# Altium schematic sheet LoRa_PWR_Monitor.SchDoc
size 420 x 297 mm; Date: TEST; SheetNumber: 1; SheetTotal: 1; Sheet_Text_ProjectName: LoRa_PWR_Monitor; Sheet_Text_Author: mtnguyen; Sheet_Text_Title: LoRa_PWR_Monitor; Sheet_Text_Rev: 1.0.0; Sheet_Text_Date: Dec 23, 24; SPICEModelCacheXPRDUAEM: <root> / <DocumentId>XPRDUAEM</DocumentId> / <CacheFrame Number="0"> / <Model Name="emk105bj105_v-f" Kind="CKT"> / <Text>* EMK105BJ105_V-F     SPICE MODEL  ( General Type ) / *-------------------------------------------------------------------------------------------------------- / * Model Generated by TAIYO YUDEN Corporation (http://www.ty-top.com) / * Version 1.0 / * TAIYO YUDEN Control No. 170508_130520 / * Copyright(c) 2012 TAIYO YUDEN CO.,LTD. All Rights Reserved. / *-------------------------------------------------------------------------------------------------------- / * / * Products Name : Multilayer Ceramic Capacitors / * / * Characteristics : / *     Capacitance : 1 uF , Rated Voltage : 16V , TCC : X5R / *     Case Size : 1.0 x 0.5 / 0.039 x 0.02 [mm/inch] , Thickness : 0.5 / 0.02 [mm/inch] / *     (Conditions: Temperature = 25 degC , DC Bias Current/Voltage = 0A / 0V) / * / * Frequency Range : 40Hz - 3GHz / * / * External Node Assignments : / * / *  1  o---| |---o  2 / * / *-------------------------------------------------------------------------------------------------------- / .SubCkt EMK105BJ105_V-F 1 2 / **************************** / C0 1 110 0.68309u / Cm 1 101 0.26053u / C1 101 102 0.94076u / Rc1 101 102 1.9029k / C2 102 103 0.66707u / Rc2 102 103 120.36 / C3 103 110 0.57203u / Rc3 103 110 2.1097 / C2m 1 301 0.1871u / C21 301 302 3.2494u / Rc21 301 302 1.1117k / C22 302 303 2.1014u / Rc22 302 303 1.484k / C23 303 304 2.1172u / Rc23 303 304 1.3876k / C24 304 305 0.75729u / Rc24 304 305 332.59 / C25 305 306 0.94401u / Rc25 305 306 249.09 / C26 306 307 0.34674u / Rc26 306 307 28.352 / C27 307 308 0.37158u / Rc27 307 308 19.989 / C28 308 309 0.17933u / Rc28 308 309 31.748 / C29 309 110 0.016445u / Rc29 309 110 1.0592 / Rp0 1 110 100Meg / L0 110 120 0.2216n / Lm 120 130 0.1509n / L1 120 121 0.12659n / RL1 121 130 0.85161 / L2 120 122 0.15996n / RL2 122 130 0.42469 / L3 120 123 7.9543n / RL3 123 130 0.54643m / CR 120 124 0.24334u / LR 124 125 0.090738n / RR 125 130 68.076m / CL 130 140 2.7354p / LL 130 140 0.10762n / RL 130 140 50.614 / Rs 140 2 7.5416m / **************************** / .ends EMK105BJ105_V-F</Text> / </Model> / </CacheFrame> / </root>
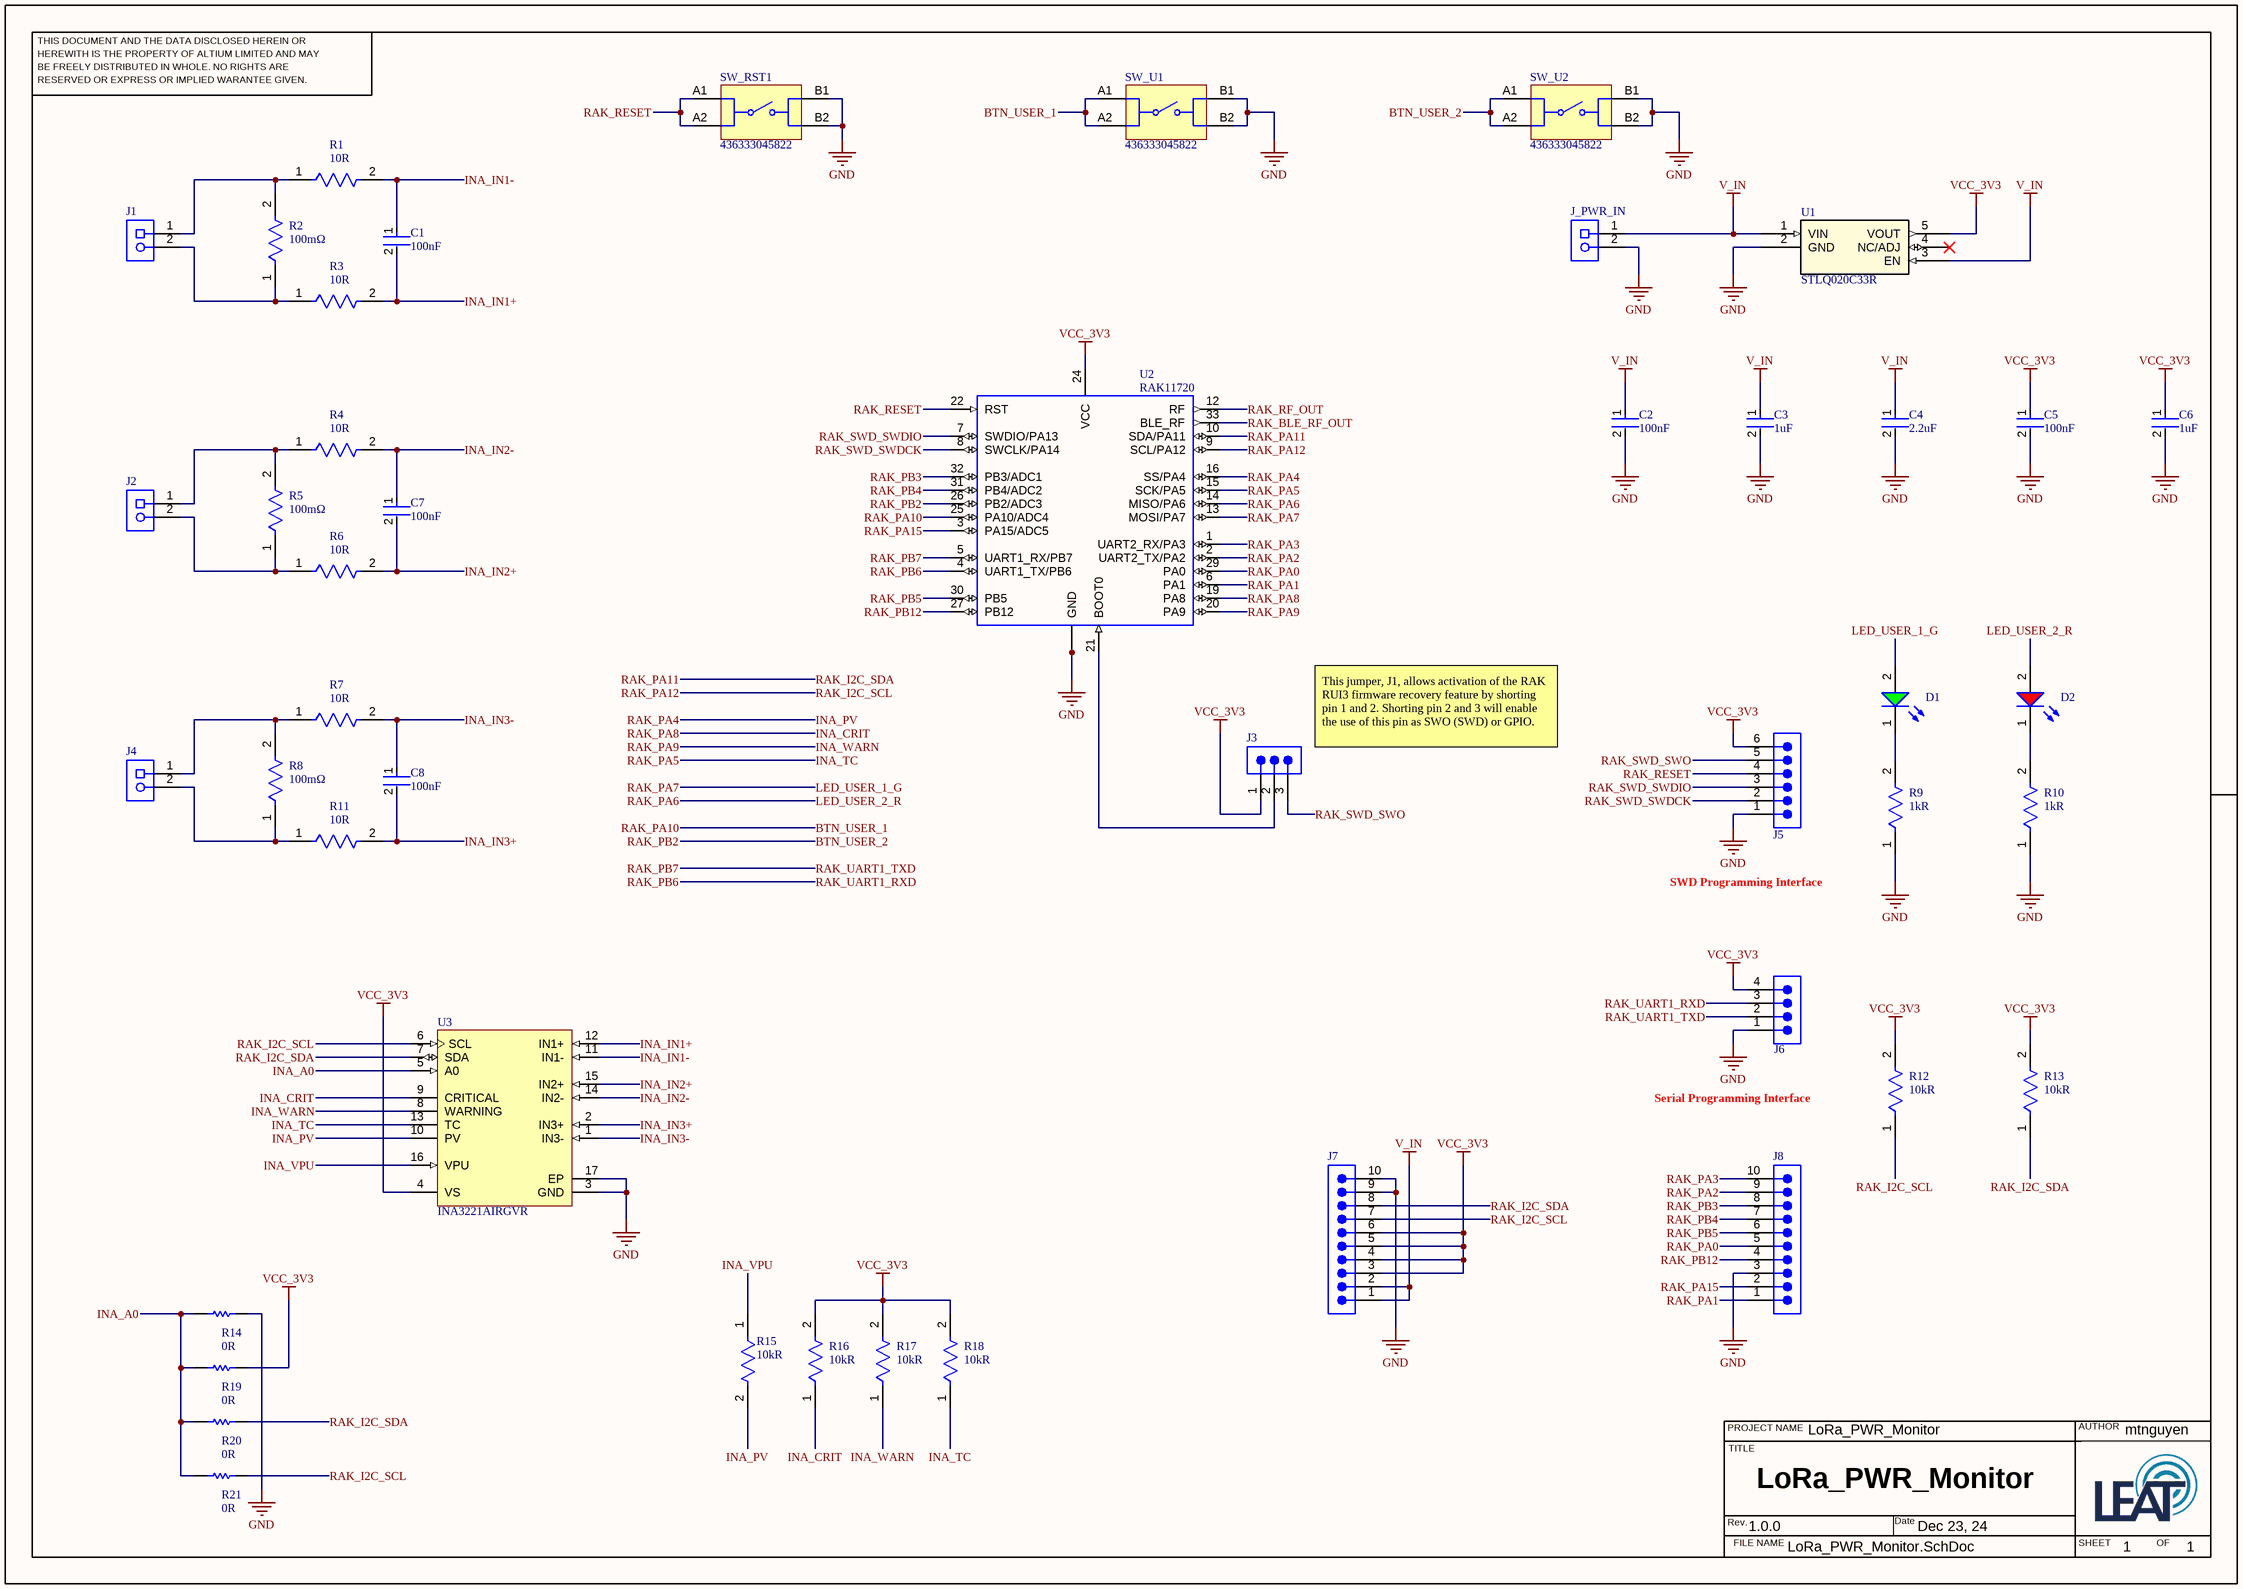
[diagram p0: LoRa_PWR_Monitor.SchDoc]

## Parts
C1  Capacitance: 100nF  [FP-0402-L_1_0_1-W_0_5_0_1-IPC_C]  (hidden comment: 0402ZD104KAT2A)
C2  Capacitance: 100nF  [FP-0402-L_1_0_1-W_0_5_0_1-IPC_C]  (hidden comment: 0402ZD104KAT2A)
C3  Capacitance: 1uF  [FP-0402-L_1_0_0_05-W_0_5-IPC_A]  (hidden comment: EMK105BJ105KV-F)
C4  Capacitance: 2.2uF  [FP-C1005-050-0_05-IPC_A]  (hidden comment: C1005X5R1A225K050BC)
C5  Capacitance: 100nF  [FP-0402-L_1_0_1-W_0_5_0_1-IPC_C]  (hidden comment: 0402ZD104KAT2A)
C6  Capacitance: 1uF  [FP-0402-L_1_0_0_05-W_0_5-IPC_A]  (hidden comment: EMK105BJ105KV-F)
C7  Capacitance: 100nF  [FP-0402-L_1_0_1-W_0_5_0_1-IPC_C]  (hidden comment: 0402ZD104KAT2A)
C8  Capacitance: 100nF  [FP-0402-L_1_0_1-W_0_5_0_1-IPC_C]  (hidden comment: 0402ZD104KAT2A)
D1  150060VS75000  [WL-SMCW_0603_150060xx75000]  (value not drawn)
D2  150060RS75000  [WL-SMCW_0603_150060xx75000]  (value not drawn)
J1  1729128  [PHOE-1729128-2_V]  (value not drawn)
J2  1729128  [PHOE-1729128-2_V]  (value not drawn)
J3  61300311121  [61300311121]  (value not drawn)
J4  1729128  [PHOE-1729128-2_V]  (value not drawn)
J5  61300611121  [61300611121]  (value not drawn)
J6  61300411121  [61300411121]  (value not drawn)
J7  61301011121  [61301011121]  (value not drawn)
J8  61301011121  [61301011121]  (value not drawn)
J_PWR_IN  1729128  [PHOE-1729128-2_V]  (value not drawn)
R1  Resistance: 10R  [FP-MCR01-IPC_C]  (hidden comment: MCR01MZPF10R0)
R2  value 100mΩ  [FP-CRM2512-MFG]  (hidden comment: CRM2512-FX-R100ELF)
R3  Resistance: 10R  [FP-MCR01-IPC_C]  (hidden comment: MCR01MZPF10R0)
R4  Resistance: 10R  [FP-MCR01-IPC_C]  (hidden comment: MCR01MZPF10R0)
R5  value 100mΩ  [FP-CRM2512-MFG]  (hidden comment: CRM2512-FX-R100ELF)
R6  Resistance: 10R  [FP-MCR01-IPC_C]  (hidden comment: MCR01MZPF10R0)
R7  Resistance: 10R  [FP-MCR01-IPC_C]  (hidden comment: MCR01MZPF10R0)
R8  value 100mΩ  [FP-CRM2512-MFG]  (hidden comment: CRM2512-FX-R100ELF)
R9  Resistance: 1kR  [FP-RMCF0402-IPC_A]  (hidden comment: RMCF0402FT1K00)
R10  Resistance: 1kR  [FP-RMCF0402-IPC_A]  (hidden comment: RMCF0402FT1K00)
R11  Resistance: 10R  [FP-MCR01-IPC_C]  (hidden comment: MCR01MZPF10R0)
R12  Resistance: 10kR  [FP-RMCF0402-IPC_C]  (hidden comment: RMCF0402FT10K0)
R13  Resistance: 10kR  [FP-RMCF0402-IPC_C]  (hidden comment: RMCF0402FT10K0)
R14  Resistance: 0R  [RESC1005X40X25LL05T10]  (hidden comment: RC1005J000CS)
R15  Resistance: 10kR  [FP-RMCF0402-IPC_C]  (hidden comment: RMCF0402FT10K0)
R16  Resistance: 10kR  [FP-RMCF0402-IPC_C]  (hidden comment: RMCF0402FT10K0)
R17  Resistance: 10kR  [FP-RMCF0402-IPC_C]  (hidden comment: RMCF0402FT10K0)
R18  Resistance: 10kR  [FP-RMCF0402-IPC_C]  (hidden comment: RMCF0402FT10K0)
R19  Resistance: 0R  [RESC1005X40X25LL05T10]  (hidden comment: RC1005J000CS)
R20  Resistance: 0R  [RESC1005X40X25LL05T10]  (hidden comment: RC1005J000CS)
R21  Resistance: 0R  [RESC1005X40X25LL05T10]  (hidden comment: RC1005J000CS)
SW_RST1  436333045822  [436333045822]
SW_U1  436333045822  [436333045822]
SW_U2  436333045822  [436333045822]
U1  STLQ020C33R  [SOT323-5L_STM]
U2  RAK11720  [RAK11720]
U3  INA3221AIRGVR  [RGV0016A_V]

## Nets
GND: C2.2 C3.2 C4.2 C5.2 C6.2 J5.1 J6.1 J7.9 J7.10 J8.3 J_PWR_IN.2 R9.1 R10.1 R14.2 SW_RST1.B1 SW_RST1.B2 SW_U1.B1 SW_U1.B2 SW_U2.B1 SW_U2.B2 U1.2(GND) U2.11(GND) U2.17(GND) U2.18(GND) U2.23(GND) U2.28(GND) U2.34(GND) U3.3(GND) U3.17(EP)
V_IN: C2.1 C3.1 C4.1 J7.1 J7.2 J_PWR_IN.1 U1.1(VIN) U1.3(EN)
VCC_3V3: C5.1 C6.1 J3.1 J5.6 J6.4 J7.3 J7.4 J7.5 J7.6 R12.2 R13.2 R16.2 R17.2 R18.2 R19.2 U1.5(VOUT) U2.24(VCC) U3.4(VS)
BTN_USER_1: SW_U1.A1 SW_U1.A2 U2.25(PA10/ADC4)  [also labelled RAK_PA10]
BTN_USER_2: SW_U2.A1 SW_U2.A2 U2.26(PB2/ADC3)  [also labelled RAK_PB2]
INA_A0: R14.1 R19.1 R20.1 R21.1 U3.5(A0)
INA_CRIT: R16.1 U2.19(PA8) U3.9(CRITICAL)  [also labelled RAK_PA8]
INA_IN1+: C1.2 R3.2 U3.12(IN1+)
INA_IN1-: C1.1 R1.2 U3.11(IN1-)
INA_IN2+: C7.2 R6.2 U3.15(IN2+)
INA_IN2-: C7.1 R4.2 U3.14(IN2-)
INA_IN3+: C8.2 R11.2 U3.2(IN3+)
INA_IN3-: C8.1 R7.2 U3.1(IN3-)
INA_PV: R15.2 U2.16(SS/PA4) U3.10(PV)  [also labelled RAK_PA4]
INA_TC: R18.1 U2.15(SCK/PA5) U3.13(TC)  [also labelled RAK_PA5]
INA_VPU: R15.1 U3.16(VPU)
INA_WARN: R17.1 U2.20(PA9) U3.8(WARNING)  [also labelled RAK_PA9]
LED_USER_1_G: D1.2(A) U2.13(MOSI/PA7)  [also labelled RAK_PA7]
LED_USER_2_R: D2.2(A) U2.14(MISO/PA6)  [also labelled RAK_PA6]
RAK_BLE_RF_OUT: U2.33(BLE_RF)
RAK_I2C_SCL: J7.7 R12.1 R21.2 U2.9(SCL/PA12) U3.6(SCL)  [also labelled RAK_PA12]
RAK_I2C_SDA: J7.8 R13.1 R20.2 U2.10(SDA/PA11) U3.7(SDA)  [also labelled RAK_PA11]
RAK_PA0: J8.5 U2.29(PA0)
RAK_PA1: J8.1 U2.6(PA1)
RAK_PA2: J8.9 U2.2(UART2_TX/PA2)
RAK_PA3: J8.10 U2.1(UART2_RX/PA3)
RAK_PA15: J8.2 U2.3(PA15/ADC5)
RAK_PB3: J8.8 U2.32(PB3/ADC1)
RAK_PB4: J8.7 U2.31(PB4/ADC2)
RAK_PB5: J8.6 U2.30(PB5)
RAK_PB6: J6.3 U2.4(UART1_TX/PB6)  [also labelled RAK_UART1_RXD]
RAK_PB7: J6.2 U2.5(UART1_RX/PB7)  [also labelled RAK_UART1_TXD]
RAK_PB12: J8.4 U2.27(PB12)
RAK_RESET: J5.4 SW_RST1.A1 SW_RST1.A2 U2.22(RST)
RAK_RF_OUT: U2.12(RF)
RAK_SWD_SWDCK: J5.2 U2.8(SWCLK/PA14)
RAK_SWD_SWDIO: J5.3 U2.7(SWDIO/PA13)
RAK_SWD_SWO: J3.3 J5.5
NetD1_1: D1.1(K) R9.2
NetD2_1: D2.1(K) R10.2
NetJ1_1: J1.1 R1.1 R2.2
NetJ1_2: J1.2 R2.1 R3.1
NetJ2_1: J2.1 R4.1 R5.2
NetJ2_2: J2.2 R5.1 R6.1
NetJ3_2: J3.2 U2.21(BOOT0)
NetJ4_1: J4.1 R7.1 R8.2
NetJ4_2: J4.2 R8.1 R11.1

Not connected (* = marked no-connect by the designer): U1 4(NC/ADJ)*

## Notes on the sheet
- (near J3) This jumper, J1, allows activation of the RAK RUI3 firmware recovery feature by shorting pin 1 and 2. Shorting pin 2 and 3 will enable the use of this pin as SWO (SWD) or GPIO.
- SWD Programming Interface
- Serial Programming Interface
- THIS DOCUMENT AND THE DATA DISCLOSED HEREIN OR
- HEREWITH IS THE PROPERTY OF ALTIUM LIMITED AND MAY
- BE FREELY DISTRIBUTED IN WHOLE. NO RIGHTS ARE
- RESERVED OR EXPRESS OR IMPLIED WARANTEE GIVEN.
- PROJECT NAME
- TITLE
- AUTHOR
- Rev.
- FILE NAME
- Date
- SHEET
- OF

## Library data of the parts
C1 C2 C5 C7 C8 = CMP-2008-02878-3: General Purpose Ceramic Capacitor, 0402, 100nF, 10%, X5R, 15%, 10V; Dissipation Factor: 5%; Insulation Resistance: 100GR; Case/Package: 0402; Termination: SMD/SMT; Thickness: 0.022inch; Packaging: Tape and Reel; REACH SVHC: No SVHC; Case Code (Imperial): 0402; Width: 0.02inch; Series: -; Construction: Flat; Dielectric: X5R; Voltage: 10V; Height: 0.56mm; Voltage Rating (DC): 10V; Depth: 0.5mm; Tolerance: 10%; Radiation Hardening: No; Voltage Rating: 10V; Package Quantity: 1; Contact Plating: Tin; RoHS Compliant: Yes; Case Code (Metric): 1005; Lead Free: Lead Free; Max Operating Temperature: 85°C; Length: 1mm; Min Operating Temperature: -55°C; Mount: Surface Mount
C3 C6 = CMP-14477-000104-2: None; Tolerance: 10%; Voltage Rating: 16V; Dielectric: X5R; Packaging: Tape and Reel; Depth: 0.5mm; Mount: Surface Mount; Thickness: 0.022inch; Package Quantity: 1; Min Operating Temperature: -55°C; Series: M; Voltage Rating (DC): 16V; Termination: SMD/SMT; Case/Package: 0402; Number of Pins: 2; Case Code (Imperial): 0402; Length: 1mm; Halogen Free: Halogen Free; Case Code (Metric): 1005; Width: 0.02inch; RoHS Compliant: Yes; Radiation Hardening: No; Max Operating Temperature: 85°C; Height: 0.5mm; Construction: Flat
C4 = CMP-08246-002709-1: Multilayer Ceramic Capacitors 2.2μF ±10% 10V X5R SMD 0402; Packaging: Tape and Reel; REACH SVHC: No SVHC; Case Code (Imperial): 0402; Voltage Rating: 10V; Radiation Hardening: No; Construction: Flat; Case/Package: 0402; Width: 0.02inch; Length: 1mm; Dielectric Material: Ceramic; Series: C; Height: 0.5mm; Depth: 0.5mm; Thickness: 0.022inch; Tolerance: 10%; Package Quantity: 1; Case Code (Metric): 1005; Min Operating Temperature: -55°C; Dielectric: X5R; Number of Pins: 2; Mount: Surface Mount; Resistor Type: Ceramic; RoHS Compliant: Yes; Weight: 2.3E-05oz; Max Operating Temperature: 85°C; Lead Free: Lead Free; Voltage: 10V; Termination: SMD/SMT; Voltage Rating (DC): 10V
D1 = CMP-1426-00006-7: WURTH ELEKTRONIK - 150060VS75000 - LED, Green, SMD, 0603, 30 mA, 2 V, 570 nm; Reverse Voltage: 5V; Power Dissipation: 72mW; Dominant Wavelength: 570nm; Peak Wavelength: 572nm; Forward Current: 100mA; Forward Voltage: 2V; Lens Style: Clear, Rectangular; Test Current: 20mA; Max Junction Temperature (Tj): 95°C; Viewing Angle: 140°; Luminous Intensity: 40mcd; Height: 700µm; Width: 800µm; Length: 1.6mm; Mount: Surface Mount; Min Operating Temperature: -40°C; Max Reverse Voltage (DC): 5V; Case Code (Imperial): 0603; Wavelength: 570nm; Color: Green; REACH SVHC: Unknown; RoHS: Compliant; Max Operating Temperature: 85°C; Packaging: Tape and Reel; Case/Package: 0603; Number of Pins: 2; Case Code (Metric): 1608
D2 = CMP-1426-00001-4: LED Low-Power Uni-Color Red 630nm 2V 2-Pin Chip 0603(1608Metric) T/R; Max Junction Temperature (Tj): 95°C; Dominant Wavelength: 625nm; Lens Style: Clear, Rectangular; Viewing Angle: 140°; Forward Current: 100mA; Max Reverse Voltage (DC): 5V; Luminous Intensity: 250mcd; Test Current: 20mA; Power Dissipation: 72mW; Max Operating Temperature: 85°C; Mount: Surface Mount; Height: 700µm; Packaging: Tape and Reel; REACH SVHC: Unknown; Case Code (Metric): 1608; Peak Wavelength: 630nm; Forward Voltage: 2V; Case/Package: 0603; Color: Red; RoHS: Compliant; Width: 800µm; Reverse Voltage: 5V; Min Operating Temperature: -40°C; Wavelength: 625nm; Case Code (Imperial): 0603; Length: 1.6mm
J1 J2 J4 J_PWR_IN = CMP-2000-05815-1: PCB Terminal Block, 13.5 A, 400 V, 2-Pin THD, RoHS, Bulk; Manufacturer: Phoenix Contact; Package Version: 03/2015; No. of Rows: 1; Pitch: 5.08mm; No. of Positions: 2; Voltage Rating: 400V; Current Rating: 13500mA; Manufacturer URL: http://www.phoenixcontact.com/; Datasheet URL: https://datasheet.ciiva.com/16046/1729128-16046181.pdf; RoHS: TRUE; Package URL: https://www.phoenixcontact.com/online/portal/pi/pxc/product_detail_page/!ut/p/b1/3VdJjqNKFDxLH8AFycySyWY2ozFsEPOMMQaDOX1XedGL_1Vdm5YXJleknhSKeBkvI6EA8ncAo3AYoDhBQGco6KN7VURTdemj9us_IEKEZo_YHiPAEWEFmDGOHMORkqKYCORBZxgL7ZoaZYcbFFUZ3fqxSY6GOuxydWUuHqz1ynmMFygu583Bob0Ewr6Sd_l-5m-kAueHiB0jpRwZwe58wwtkpxtMYd_LmGcDRU02dRNEyWt6Y2ti5pSyJ_reIkzIulrqApdnbT11V5jnCKbYNCvhEM1MCpPByat_X379-iThf08CI5GfOPqfBeS3BRoBOdD55AKVv0iLwCMq-2BrzXWSGRH7pUGD9uwXQjiph3xL0DKQwdGa0JImiIOmBNOestqgwTHSSs2oOep-78apyXQBvNi8ZLaFjvjWvcaUEBu0MC6Wbe-d6mB0FAebo2lUWinqYaZs5DAYzV0RP9yitUjnGJ0iI9xhZkT42OCQNUJJhkgWINNQLP2JFP6OpMg3JCVg70jqHT0lvKOnhHf0lPuOnnLf0VPuWx6_dxwUIvwk5WMkT0kLL1mh61l2yZVSzG3pYV_bqo-mj6uMKwKwdnnW8Jh5RTOJzMOA5c-eJDaZQw4mTMPH02PvS_ZAqNVjVTo2WyYLkwH_KU1mmmG5kjRhDqPXLwwVHvVOjCM60-fpXvTDfMGW1PVFVS1r4e4yVDk4ZdNbkUHvqPqQSeian4UD39fNKmachqdJ1NJbyk8rXT9mXTvPk3oE5meulKGgiruPJek-4I9hTT6G8ZLOyRSm2RRVbThERQad5OS28hdt4YW4vG0stgYYzsWsK4_7y6DZMjJSCqri1kyiZR5vD7pwIrNR7QwPHTcLTI5qT7eRlpHrdGiupYlqQDJ7zy_CND8fWWBoLRXxk1RVcXiBQwbTD4Xi7KL-FuO94t9xaqweXzH; PartNumber: 1729128; Package Description: 2-Pin Through Hole Device, Body 8.1 x 10.16 mm, Pitch 5.08 mm; Datasheet Version: 12/2013; Mounting Technology: ThroughHole; Orientation: Horizontal; Package Reference: 1729128-2; Packing: Bulk
J3 = CMP-1502-01062-3: NexarPartId: 32855521; Current Rating: 3A; Voltage Rating: 250V; Number of Positions: 3; Pitch: 2.54mm; Contact Resistance: 20mΩ; Connector Type: Male Pin; Gender: Male; REACH SVHC: Unknown; Packaging: Bulk; Contact Material: Copper; Min Operating Temperature: -40°C; Number of Rows: 1; Orientation: Vertical; RoHS: Compliant; Contact Plating: Gold; Max Operating Temperature: 105°C; Mount: Through Hole; Height: 8.94mm; Operating Supply Voltage: 250V; Number of Pins: 3; Contact Mating Length: 5.9944mm; Number of Contacts: 3; Color: Black; Lead Free: Lead Free; Lead Pitch: 2.54mm; Termination: Solder
J5 = CMP-1502-01070-3: NexarPartId: 20084590; Current Rating: 3A; Pitch: 2.54mm; Gender: Male; Operating Supply Voltage: 250V; Connector Type: Male Pin; Number of Positions: 6; Contact Resistance: 20mΩ; Packaging: Bulk; Number of Pins: 6; Number of Rows: 1; Contact Plating: Gold; Lead Free: Lead Free; RoHS: Compliant; Contact Mating Length: 5.9944mm; Voltage Rating: 250V; REACH SVHC: Unknown; Contact Gender: Male; Housing Material: PBT; Min Operating Temperature: -40°C; Lead Pitch: 2.54mm; Mount: Through Hole; Number of Contacts: 6; Max Operating Temperature: 105°C; Contact Material: Copper; Orientation: Vertical; Termination: Through Hole; Color: Black; Height: 8.89mm
J6 = CMP-1502-01064-3: NexarPartId: 32855522; Operating Supply Voltage: 250V; Pitch: 2.54mm; Contact Resistance: 20mΩ; Number of Positions: 4; Current Rating: 3A; Connector Type: Male Pin; Gender: Male; Contact Plating: Gold; Height: 8.89mm; Lead Pitch: 2.54mm; Lead Free: Lead Free; Contact Mating Length: 5.9944mm; Number of Rows: 1; Termination: Solder; Packaging: Bulk; REACH SVHC: Unknown; Min Operating Temperature: -40°C; RoHS: Compliant; Number of Contacts: 4; Voltage Rating: 250V; Color: Black; Max Operating Temperature: 105°C; Contact Material: Copper; Mount: Through Hole; Orientation: Vertical; Number of Pins: 4
J7 J8 = CMP-1502-01082-5: NexarPartId: 18818159; Gender: Male; Number of Positions: 10; Operating Supply Voltage: 250V; Current Rating: 3A; Contact Resistance: 20mΩ; Connector Type: Male Pin; Insulation Resistance: 1GΩ; Pitch: 2.54mm; Color: Black; Contact Gender: Male; Height: 8.74mm; Orientation: Vertical; RoHS: Compliant; Packaging: Bulk; Min Operating Temperature: -40°C; Number of Pins: 10; Max Operating Temperature: 105°C; REACH SVHC: Unknown; Voltage Rating: 250V; Number of Rows: 1; Housing Material: PBT; Number of Contacts: 10; Mount: Through Hole; Contact Mating Length: 5.9944mm; Length: 2.54mm; Lead Pitch: 2.54mm; Flammability Rating: UL94 V-0; Termination: Solder; Contact Material: Copper; Width: 25.4mm; Contact Plating: Gold
R1 R3 R4 R6 R7 R11 = CMP-08839-005217-1: Thick Film Chip Resistor, 0402, 10Ω, 1%, 100ppm/°C, 0.063W, 50V; Max Power Dissipation: 63mW; Temperature Coefficient: 400ppm/°C; Military Standard: Not; Packaging: Tape and Reel; Case Code (Metric): 1005; Width: 0.02inch; Depth: 0.5mm; Number of Terminations: 2; Construction: Rectangular; Length: 0.039inch; Case/Package: 0402; Package Quantity: 10000; Mount: Surface Mount; Lead Free: Lead Free; Features: Automotive AEC-Q200; Min Operating Temperature: -55°C; Voltage Rating (DC): 50V; Height: 0.016inch; Power Rating: 63mW; Max Operating Temperature: 155°C; Case Code (Imperial): 0402; Resistor Type: Thick Film; Size Code: 0402; RoHS Compliant: Yes; Tolerance: 1%; Series: MCR01
R2 R5 R8 = CMP-07231-000004-1: RES 0.1 OHM 1% 2W 2512; Manufacturer: Bourns; 3DS Part Number: 110-00004; Voltage: 1.349V; Temperature Coefficient: 100ppm/°C; Voltage Rating: 1349mV; ComponentLink2Description: Datasheet; Lead Free: Yes; RoHS: TRUE; Ipc Land Pattern Name: RESC630310X60; Temperature: -55°C to +155°C; Package: CRM2512; Temperature Range High: +155°C; Mouser Description: Thick Film Resistors 2watts 1% .1ohms 100 PPM 2512; Category: Res; Temperature Range Low: -55°C; Resistance: 100mΩ; Series: CRM2512; Device Class L3: Chip SMD Resistors; Composition: Thick Film; Height: 0.8mm; Device Class L2: Resistors; Automotive: No; Device Class L1: Passive Components; Octopart: https://octopart.com/crm2512-fx-r100elf-bourns-9081968; Digikey Description: RES 0.1 OHM 1% 2W 2512; Power Rating: 2W; ComponentLink2URL: https://www.bourns.com/docs/product-datasheets/crm.pdf?sfvrsn=580c66f6_5; Manufacturer Part Number: CRM2512-FX-R100ELF; Tolerance: 1%
R9 R10 = CMP-26527-000026-1: 1kΩ ±1% 0.063W 0402 Thick Film Chip Resistor AEC-Q200 compliant; Temperature Coefficient: 100ppm/°C; Power Rating: 63mW; Length: 1mm; RoHS Compliant: Yes; Construction: Rectangular; Height: 0.016inch; Size Code: 0402; Lead Free: Lead Free; Radiation Hardening: No; Tolerance: 1%; Width: 0.02inch; Military Standard: Not; Resistor Type: Thick Film; Number of Terminations: 2; Min Operating Temperature: -55°C; Max Operating Temperature: 155°C; Depth: 0.5mm; Features: Automotive AEC-Q200; Packaging: Tape and Reel; Case Code (Metric): 1005; Mount: Surface Mount; Contact Plating: Tin; Max Power Dissipation: 63mW; Case/Package: 0402; Case Code (Imperial): 0402; Series: RMCF
R12 R13 R15-R18 = CMP-26527-000128-1: 10kΩ ±1% 0.063W 0402 Thick Film Chip Resistor AEC-Q200 compliant; Temperature Coefficient: 100ppm/°C; Power Rating: 62.5mW; Max Power Dissipation: 63mW; Width: 0.02inch; Case/Package: 0402; Depth: 0.5mm; Resistor Type: Thick Film; Series: RMCF; Length: 1mm; Contact Plating: Tin; Tolerance: 1%; Number of Terminations: 2; Height: 0.016inch; Military Standard: Not; Case Code (Imperial): 0402; Size Code: 0402; Construction: Rectangular; Radiation Hardening: No; RoHS Compliant: Yes; Case Code (Metric): 1005; Packaging: Tape and Reel; Lead Free: Lead Free; Min Operating Temperature: -55°C; Max Operating Temperature: 155°C; Mount: Surface Mount; Features: Automotive AEC-Q200
R14 R19-R21 = CMP-2000-06964-1: Chip Resistor, 0 Ohm, +/- 5%, -55 to 125 degC, 0402 (1005 Metric), RoHS, Tape and Reel; Manufacturer: Samsung Electro-Mechanics; Temp Coefficient: ±200ppm/°C; Rated Power: 0.063W; Manufacturer URL: http://www.samsungsem.com/global/index.jsp; Tolerance (%): ±5%; Package Reference: 0402; Mounting Technology: SurfaceMount; Datasheet Version: 11/2010; Size Code: 0402; Package Description: 2-Pin Surface Mount Device, Body 1 x 0.5 mm; Datasheet URL: https://datasheet.ciiva.com/15196/getdatasheetpartid-499011-15196236.pdf
SW_RST1 SW_U1 SW_U2 = CMP-1464-00001-2: NexarPartId: 22866045; Voltage Rating: 12V; Contact Resistance: 100mΩ; Operating Force: 220N; Current Rating: 50mA; Height: 1.65mm; Contact Plating: Silver; Min Operating Temperature: -40°C; Insulation Resistance: 100MΩ; Max Operating Temperature: 85°C; RoHS: Compliant; Packaging: Tape and Reel; Width: 4.7mm; Contact Current Rating: 50mA
U1 = STLQ020C33R: No Description Available; Mfr_Name: STMicroelectronics; Copyright: Copyright (C) 2023 Ultra Librarian. All rights reserved.; Manufacturer_Part_Number: STLQ020C33R; RefDes: RefDes; Type: DEV
U2 = RAK11720: RAK11720 Ambiq Apollo3 Blue SX1262 LoRa Bluetooth Module for LoRaWAN; MP: RAK3172; MF: Shenzhen RAKwireless Technology Co.,Ltd.; Value: *; Check_prices: https://www.snapeda.com/parts/RAK3172/Shenzhen+RAKwireless+Technology+Co.%252CLtd./view-part/?ref=eda; Package: Package; Price: None; Availability: Not in stock; SnapEDA_Link: https://www.snapeda.com/parts/RAK3172/Shenzhen+RAKwireless+Technology+Co.%252CLtd./view-part/?ref=snap
U3 = CMP-0704-00001-2: Triple Channel Shunt and Bus Voltage Monitor, 120 dB, 2.7 to 5.5 V, -40 to 125 degC, 16-Pin VQFN (RGV), Green (RoHS & no Sb/Br), Tape and Reel; Manufacturer: Texas Instruments; Rating: Catalog; Quiescent Current (Typ): 350 uA; Gain Error (max): 0.25%; CMR (Typ): 120 dB; Offset Voltage (max): +/- 80 uV; Gain: 1 V/V; Voltage Input Range (Bus): 0 to 26 V; ComponentLink2Description: Datasheet; PackageDescription: 16-Pin Quad Flat No-lead Package, Body 4 x 4 mm, Pitch 0.65 mm; ComponentLink3URL: http://www.ti.com/lit/ds/symlink/ina3221.pdf; PartNumber: INA3221AIRGVR; Operating Supply Range: 2.7 to 5.5 V; DatasheetVersion: SBOS576A; Temperature Range: -40 to 125 degC; ComponentLink1Description: Manufacturer URL; ComponentLink1URL: http://www.ti.com/; RoHS: TRUE; ComponentLink3Description: Package Specification; Packing: Tape and Reel; Mounting Technology: Surface Mount; ComponentLink2URL: http://www.ti.com/lit/ds/symlink/ina3221.pdf; PackageVersion: SBOS576A; PackageReference: RGV0016A